# Altium project Nixie_Control.PrjPcb
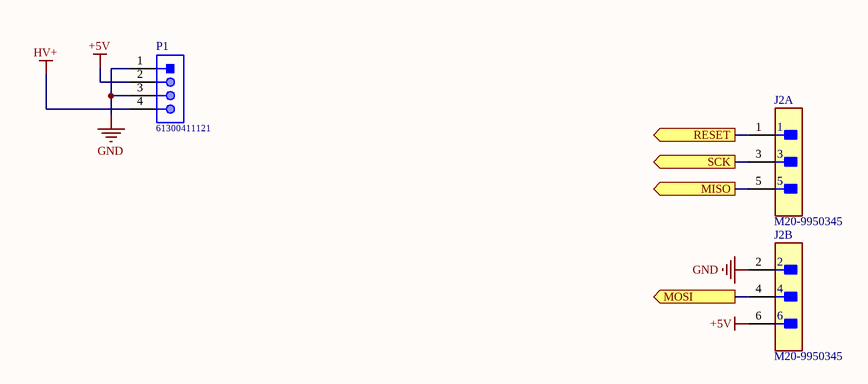
[diagram p0: Connectors.SchDoc]
4 sheets, 32 parts. Net scope: flat (ports and power ports of the same name join across sheets).
Board file: Nixie_Control.PcbDoc
Sheets:
  Connectors.SchDoc
  IN_12A.SchDoc
  ATMega1284p.SchDoc
  DS1307.SchDoc

## Sheet Connectors.SchDoc
size A; SheetNumber: 1; SheetTotal: 4

### Parts
J2  M20-9950345  [FP-M20-9950345-MFG]  (parts A,B of 2)
P1  61300411121  [61300411121]

### Ports
MISO (out), MOSI (out), RESET (out), SCK (out)

### Nets
+5V: J2.6 P1.2
GND: J2.2 P1.1 P1.3
HV+: P1.4
NetJ2_1: J2.1 ; port RESET
NetJ2_3: J2.3 ; port SCK
NetJ2_4: J2.4 ; port MOSI
NetJ2_5: J2.5 ; port MISO

### Library data of the parts
J2 = CMP-15831-000002-1: CONN HEADER R/A 6POS 2.54MM; Manufacturer: Harwin; Conn Gender: Male; Number Of Contacts: 6; Conn Orientation: Right Angle; Current Rating: 3A; Device Class L2: Headers and Wire Housings; Temperature: -40°C to +105°C; Device Class L1: Connectors; RoHS: TRUE; Temperature Range Low: -40°C; ComponentLink2URL: https://cdn.harwin.com/pdfs/M20-995.pdf; Height: 5.28mm; Digikey Description: CONN HEADER R/A 6POS 2.54MM; Pitch: 2.54mm; Manufacturer Part Number: M20-9950345; Device Class L3: unset; Ipc Land Pattern Name: DFN400X400X80-14; Automotive: No; Octopart: https://octopart.com/m20-9950345-harwin-21265213; Category: Conn; Mouser Description: Headers & Wire Housings 03+03 DIL HORIZONTAL PIN HEADER GOLD HT; Package: 0; Number Of Rows: 2; Contact Material: Gold,Nickel; Lead Free: Yes; ComponentLink2Description: Datasheet; Temperature Range High: +105°C
P1 = CMP-1502-01064-1: THT Vertical Pin Header WR-PHD, Pitch 2.54 mm, Single Row, 4 pins; Manufacturer: Wurth Elektronik; Withstanding Voltage: 500VAC; Rated Current: 3A; Working Voltage: 250VAC; Pin Number: 4; Gender: Male; Contact Resistance: 20mOhm; Pitch: 2.54mm; Manufacturer URL: http://www.we-online.de; Operating Temperature: -40to105degC; Packaging: Bag; Mounting Technology: THT; Package Reference: 61300411121; Datasheet URL: https://katalog.we-online.de/em/datasheet/6130xx11121.pdf; Publisher: WurthElektronik; Part Number: 61300411121; Row Number: Single; Orientation: Vertical

## Sheet IN_12A.SchDoc
size 431 x 279 mm; SheetNumber: 2; SheetTotal: 7
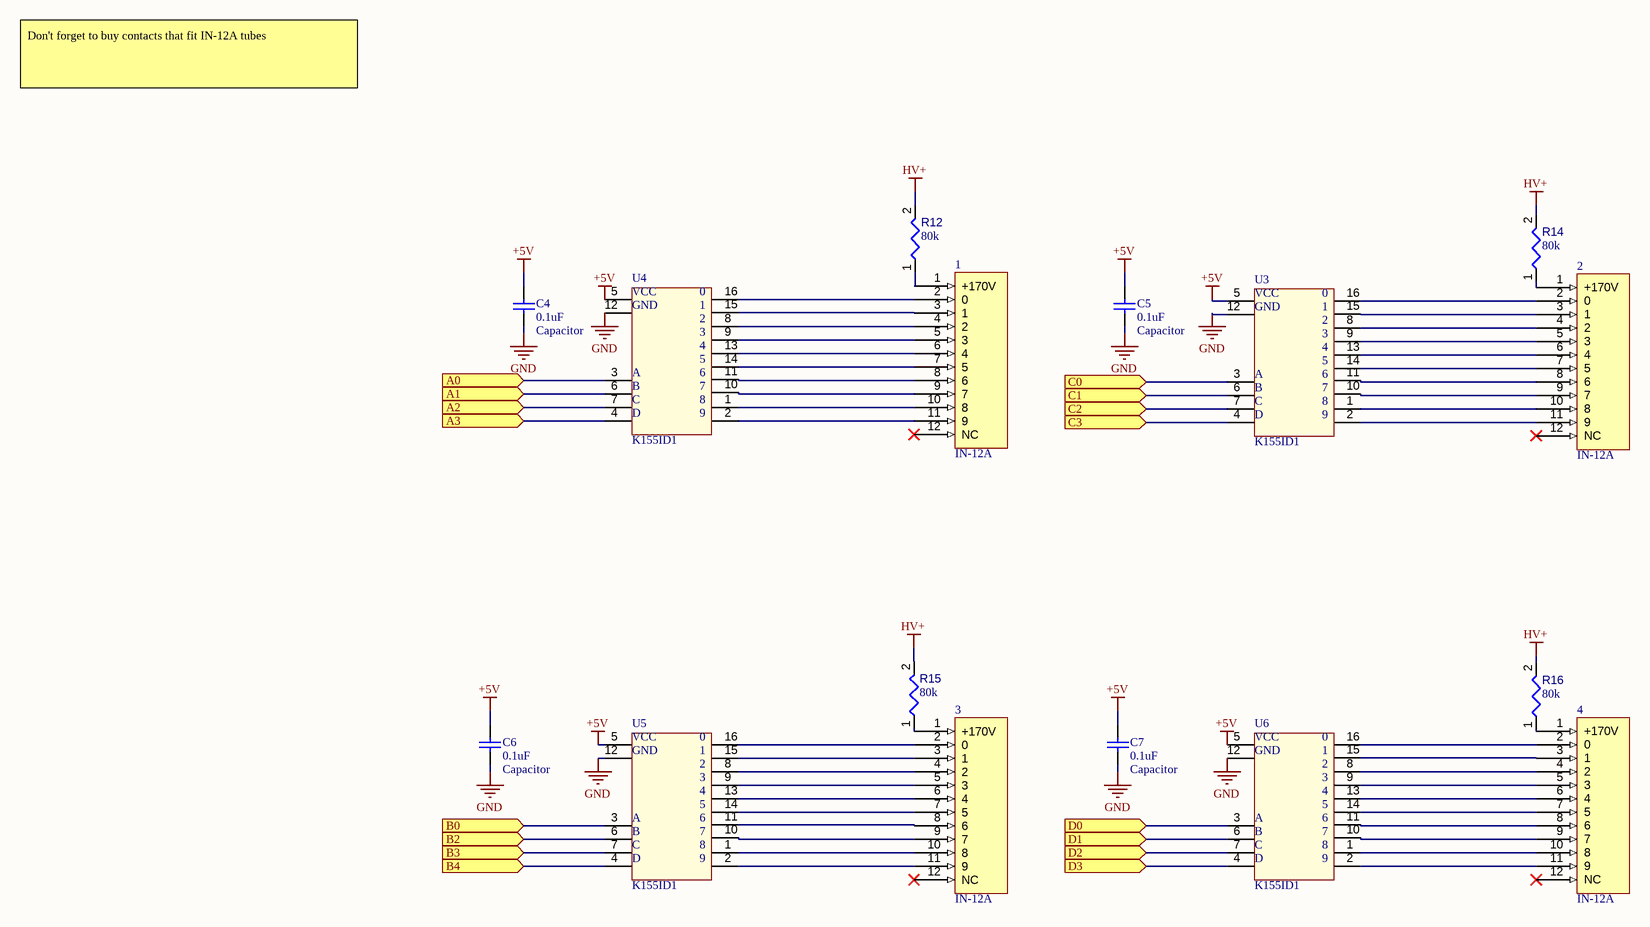
[diagram p1: IN_12A.SchDoc]

### Parts
1  IN-12A  [IN-12A]
2  IN-12A  [IN-12A]
3  IN-12A  [IN-12A]
4  IN-12A  [IN-12A]
C4  value 0.1uF  Type: Capacitor  [FOOTPRINT-1206-GEN]  (hidden comment: Capacitor - 0.1uF - 1206)
C5  value 0.1uF  Type: Capacitor  [FOOTPRINT-1206-GEN]  (hidden comment: Capacitor - 0.1uF - 1206)
C6  value 0.1uF  Type: Capacitor  [FOOTPRINT-1206-GEN]  (hidden comment: Capacitor - 0.1uF - 1206)
C7  value 0.1uF  Type: Capacitor  [FOOTPRINT-1206-GEN]  (hidden comment: Capacitor - 0.1uF - 1206)
R12  value 80k  [RESC3216X60X45ML15T20]  (hidden comment: Resistor 80k +/-1% 1206 250 mW)
R14  value 80k  [RESC3216X60X45ML15T20]  (hidden comment: Resistor 80k +/-1% 1206 250 mW)
R15  value 80k  [RESC3216X60X45ML15T20]  (hidden comment: Resistor 80k +/-1% 1206 250 mW)
R16  value 80k  [RESC3216X60X45ML15T20]  (hidden comment: Resistor 80k +/-1% 1206 250 mW)
U3  K155ID1  [Socket_DIP_16]
U4  K155ID1  [Socket_DIP_16]
U5  K155ID1  [Socket_DIP_16]
U6  K155ID1  [Socket_DIP_16]

### Ports
A0 (in), A1 (in), A2 (in), A3 (in), B0 (in), B2 (in), B3 (in), B4 (in), C0 (in), C1 (in), C2 (in), C3 (in), D0 (in), D1 (in), D2 (in), D3 (in)

### Nets
+5V: C4.2 C5.2 C6.2 C7.2 U3.5 U4.5 U5.5 U6.5
GND: C4.1 C5.1 C6.1 C7.1 U3.12 U4.12 U5.12 U6.12
HV+: R12.2 R14.2 R15.2 R16.2
Net1_1: 1.1(+170V) R12.1
Net1_2: 1.2(0) U4.16
Net1_3: 1.3(1) U4.15
Net1_4: 1.4(2) U4.8
Net1_5: 1.5(3) U4.9
Net1_6: 1.6(4) U4.13
Net1_7: 1.7(5) U4.14
Net1_8: 1.8(6) U4.11
Net1_9: 1.9(7) U4.10
Net1_10: 1.10(8) U4.1
Net1_11: 1.11(9) U4.2
Net2_1: 2.1(+170V) R14.1
Net2_2: 2.2(0) U3.16
Net2_3: 2.3(1) U3.15
Net2_4: 2.4(2) U3.8
Net2_5: 2.5(3) U3.9
Net2_6: 2.6(4) U3.13
Net2_7: 2.7(5) U3.14
Net2_8: 2.8(6) U3.11
Net2_9: 2.9(7) U3.10
Net2_10: 2.10(8) U3.1
Net2_11: 2.11(9) U3.2
Net3_1: 3.1(+170V) R15.1
Net3_2: 3.2(0) U5.16
Net3_3: 3.3(1) U5.15
Net3_4: 3.4(2) U5.8
Net3_5: 3.5(3) U5.9
Net3_6: 3.6(4) U5.13
Net3_7: 3.7(5) U5.14
Net3_8: 3.8(6) U5.11
Net3_9: 3.9(7) U5.10
Net3_10: 3.10(8) U5.1
Net3_11: 3.11(9) U5.2
Net4_1: 4.1(+170V) R16.1
Net4_2: 4.2(0) U6.16
Net4_3: 4.3(1) U6.15
Net4_4: 4.4(2) U6.8
Net4_5: 4.5(3) U6.9
Net4_6: 4.6(4) U6.13
Net4_7: 4.7(5) U6.14
Net4_8: 4.8(6) U6.11
Net4_9: 4.9(7) U6.10
Net4_10: 4.10(8) U6.1
Net4_11: 4.11(9) U6.2
NetU1_13: U5.3 ; port B0
NetU1_14: U5.6 ; port B2
NetU1_15: U5.7 ; port B3
NetU1_16: U5.4 ; port B4
NetU1_19: U6.3 ; port D0
NetU1_20: U6.6 ; port D1
NetU1_21: U6.7 ; port D2
NetU1_22: U6.4 ; port D3
NetU1_23: U4.3 ; port A0
NetU1_24: U4.6 ; port A1
NetU1_25: U4.7 ; port A2
NetU1_26: U4.4 ; port A3
NetU1_30: U3.4 ; port C3
NetU1_31: U3.7 ; port C2
NetU1_32: U3.6 ; port C1
NetU1_33: U3.3 ; port C0

Not connected (* = marked no-connect by the designer): 1 12(NC)*; 2 12(NC)*; 3 12(NC)*; 4 12(NC)*

### Notes on the sheet
- Don't forget to buy contacts that fit IN-12A tubes
- DWG. NO.
- REV.
- SHT.
- THIS DOCUMENT AND THE DATA DISCLOSED HEREIN OR HEREWITH IS THE PROPERTY OF ALTIUM LIMITED AND MAY BE FREELY DISTRIBUTED IN WHOLE. NO RIGHTS ARE RESERVED OR EXPRESS OR IMPLIED WARANTEE GIVEN.
- REVISION
- DESCRIPTION
- DATE
- APPROVED
- ENG:
- APPROVALS
- PROJECT
- DSN:
- CHK:
- REFERENCE DOCUMENTS
- PROJECT REVISION:
- TITLE
- DOCUMENT REVISION:
- DESIGN ITEM:
- BOM:
- FAB DWG:
- PCB DWG:
- ASSY DWG:
- SCALE:
- SIZE
- B
- CAGE CODE
- FILE NAME
- DWG NO.
- SHEET
- OF
- REV
- (in symbol K155ID1) VCC; 0; GND; A; B; C; D

### Library data of the parts
C4-C7 = CMP-001-00096-1: CAP CER 0.1UF 50V X7R 1206; Part Number: 1276-7034-1-ND; PackageReference: RAD-0.3; Published: 8-Jun-2000; Source: Generic.SchLib; Design Item ID: Capacitor-Generic-1206; LatestRevisionNote: Re-released for DXP Platform.; PackageDescription: Radial Cap, Thru-Hole; 2 Leads; 0.3 in Pin Spacing; Publisher: Altium Limited
R12 R14-R16 = CMP-009-00016-4: Chip Resistor, 80 KOhm, +/- 1%, 0.25 W, -55 to 155 degC, 1206 (3216 Metric); Power: 250mW; Voltage Rating: 200V; Max Operating Temperature: 155°C; Mounting Technology: SM; Case/Package: 1206; Pins: 2; Min Operating Temperature: -55°C; RoHS Compliant: True; Tolerance: 1%

## Sheet ATMega1284p.SchDoc
size A; SheetNumber: 3; SheetTotal: 4
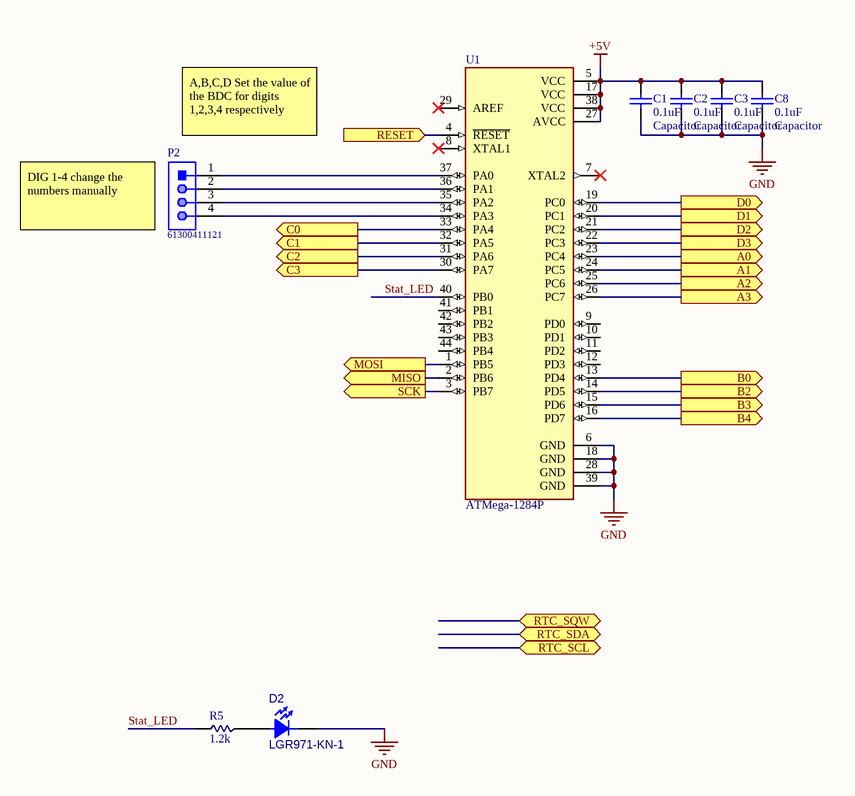
[diagram p2: ATMega1284p.SchDoc]

### Parts
C1  value 0.1uF  Type: Capacitor  [FOOTPRINT-1206-GEN]  (hidden comment: Capacitor - 0.1uF - 1206)
C2  value 0.1uF  Type: Capacitor  [FOOTPRINT-1206-GEN]  (hidden comment: Capacitor - 0.1uF - 1206)
C3  value 0.1uF  Type: Capacitor  [FOOTPRINT-1206-GEN]  (hidden comment: Capacitor - 0.1uF - 1206)
C8  value 0.1uF  Type: Capacitor  [FOOTPRINT-1206-GEN]  (hidden comment: Capacitor - 0.1uF - 1206)
D2  LGR971-KN-1  [FOOTPRINT-OSRAM-CHIPLED-0805-1A2K]
P2  61300411121  [61300411121]
R5  value 1.2k  [FOOTPRINT-0805-GEN]  (hidden comment: RMCF0805FT1K20)
U1  ATMega-1284P  [QFP80P1200X1200X120-44N]

### Ports
A0 (out), A1 (out), A2 (out), A3 (out), B0 (out), B2 (out), B3 (out), B4 (out), C0 (out), C1 (out), C2 (out), C3 (out), D0 (out), D1 (out), D2 (out), D3 (out), MISO (out), MOSI (out), RESET (in), RTC_SCL (bidir), RTC_SDA (bidir), RTC_SQW (bidir), SCK (out)

### Nets
+5V: C1.2 C2.2 C3.2 C8.2 U1.5(VCC) U1.17(VCC) U1.27(AVCC) U1.38(VCC)
GND: C1.1 C2.1 C3.1 C8.1 D2.2(K) U1.6(GND) U1.18(GND) U1.28(GND) U1.39(GND)
Stat_LED: R5.2 U1.40(PB0)
NetD2_1: D2.1(A) R5.1
NetJ2_1: U1.4(~{RESET}) ; port RESET
NetJ2_3: U1.3(PB7) ; port SCK
NetJ2_4: U1.1(PB5) ; port MOSI
NetJ2_5: U1.2(PB6) ; port MISO
NetP2_1: P2.1 U1.37(PA0)
NetP2_2: P2.2 U1.36(PA1)
NetP2_3: P2.3 U1.35(PA2)
NetP2_4: P2.4 U1.34(PA3)
NetU1_13: U1.13(PD4) ; port B0
NetU1_14: U1.14(PD5) ; port B2
NetU1_15: U1.15(PD6) ; port B3
NetU1_16: U1.16(PD7) ; port B4
NetU1_19: U1.19(PC0) ; port D0
NetU1_20: U1.20(PC1) ; port D1
NetU1_21: U1.21(PC2) ; port D2
NetU1_22: U1.22(PC3) ; port D3
NetU1_23: U1.23(PC4) ; port A0
NetU1_24: U1.24(PC5) ; port A1
NetU1_25: U1.25(PC6) ; port A2
NetU1_26: U1.26(PC7) ; port A3
NetU1_30: U1.30(PA7) ; port C3
NetU1_31: U1.31(PA6) ; port C2
NetU1_32: U1.32(PA5) ; port C1
NetU1_33: U1.33(PA4) ; port C0

Not connected (* = marked no-connect by the designer): U1 7(XTAL2)* 8(XTAL1)* 9(PD0) 10(PD1) 11(PD2) 12(PD3) 29(AREF)* 41(PB1) 42(PB2) 43(PB3) 44(PB4)

### Notes on the sheet
- (near P2) A,B,C,D Set the value of the BDC for digits 1,2,3,4 respectively
- (near P2) DIG 1-4 change the numbers manually

### Library data of the parts
C1-C3 C8 = CMP-001-00096-1: as C4 on sheet IN_12A; PackageReference: RAD-0.3; Published: 8-Jun-2000; Source: Generic.SchLib; Design Item ID: Capacitor-Generic-1206; LatestRevisionNote: Re-released for DXP Platform.; PackageDescription: Radial Cap, Thru-Hole; 2 Leads; 0.3 in Pin Spacing; Publisher: Altium Limited
D2 = CMP-017-000003-2: LED Uni-Color Green 572nm 2-Pin Chip 0805(2012Metric) T/R; Part Number: 475-1410-1-ND; Current - Maximum: 25mA; Current - Test: 20mA; Forward Voltage: 2.2V; Design Item ID: LED-OSRAM-LG-R971-KN-1; Source: Discrete.SchLib
P2 = CMP-1502-01064-1: as P1 on sheet Connectors; Manufacturer URL: http://www.we-online.de; Operating Temperature: -40to105degC; Packaging: Bag; Mounting Technology: THT; Package Reference: 61300411121; Datasheet URL: https://katalog.we-online.de/em/datasheet/6130xx11121.pdf; Publisher: WurthElektronik; Part Number: 61300411121; Row Number: Single; Orientation: Vertical
R5 = CMP-009-00185-2: Res Thick Film 0805 1.2K Ohm 1% 0.125W ±100ppm/°C Molded SMD Paper T/R; Design Item ID: Resistor-Generic-0805-2012; Source: Generic.SchLib; Type: Resistor

## Sheet DS1307.SchDoc
size A; SheetNumber: 6; SheetTotal: 7
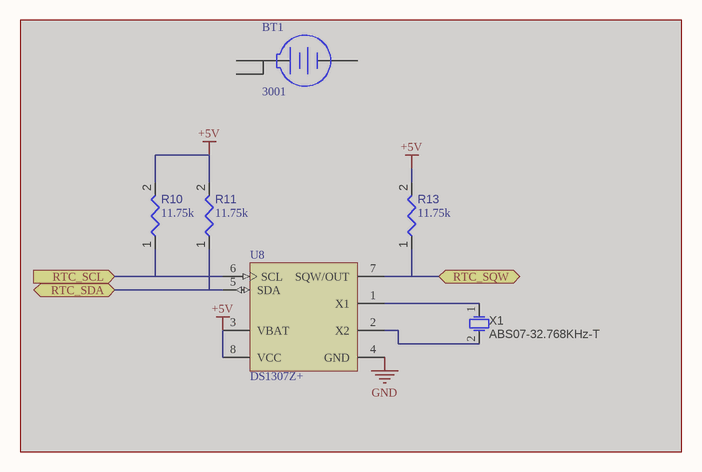
[diagram p3: DS1307.SchDoc]

### Parts
BT1  3001  [KSTN-3001_V]  (masked out: inside a compile mask, not in the netlist)
R10  value 11.75k  [RESC3216X60X45ML15T20]  (hidden comment: Resistor 11.75k +/-1% 1206 250 mW)  (masked out: inside a compile mask, not in the netlist)
R11  value 11.75k  [RESC3216X60X45ML15T20]  (hidden comment: Resistor 11.75k +/-1% 1206 250 mW)  (masked out: inside a compile mask, not in the netlist)
R13  value 11.75k  [RESC3216X60X45ML15T20]  (hidden comment: Resistor 11.75k +/-1% 1206 250 mW)  (masked out: inside a compile mask, not in the netlist)
U8  DS1307Z+  [S8+2_L]  (masked out: inside a compile mask, not in the netlist)
X1  ABS07-32.768KHz-T  [ABRA-ABS07-2_V]  (masked out: inside a compile mask, not in the netlist)

### Ports
RTC_SCL (in), RTC_SDA (bidir), RTC_SQW (bidir)

### Library data of the parts
BT1 = CMP-2000-05463-1: Holder Battery Coin, 12 mm, 2-Pin THD, RoHS; Manufacturer: Keystone; Package Reference: 3001; Package Description: 2-Pin Through Hole Device, Body 13.21 x 12.07 mm; Datasheet Version: Rev. H, 09/2006; Datasheet URL: https://datasheet.ciiva.com/3/3001-3954.pdf; Mounting Technology: ThroughHole; Manufacturer URL: http://www.keyelco.com/
R10 R11 R13 = CMP-009-00016-4: Chip Resistor, 11.75KOhm, +/- 1%, 0.25 W, -55 to 155 degC, 1206 (3216 Metric); Power: 250mW; Voltage Rating: 200V; Max Operating Temperature: 155°C; Mounting Technology: SM; Case/Package: 1206; Pins: 2; Min Operating Temperature: -55°C; RoHS Compliant: True; Tolerance: 1%
U8 = CMP-0254-00308-1: 64 x 8, Serial, I2C Real-Time Clock, 5.0V, 8-Pin SO, 0 to 70 degC, Pb-Free; ComponentLink3Description: Package Specification; DatasheetVersion: 10-Feb-2008; Code_IPC: SOIC127P600-8; ComponentLink2Description: Datasheet; Code_JEDEC: MS-012-AA; ComponentLink2URL: http://datasheets.maxim-ic.com/en/ds/DS1307.pdf; ComponentLink3URL: http://pdfserv.maxim-ic.com/package_dwgs/21-0041.PDF; ComponentLink1URL: http://www.maxim-ic.com; PackageReference: S8+2; ComponentLink1Description: Manufacturer URL; PackageDescription: 8-Pin Small-Outline IC, Narrow (0.15in), 1.27 mm Pitch, SOIC (N), Pb-Free; PackageVersion: revC, 2010
X1 = CMP-003-00022-1: Low Profile Crystal, 32.768 kHz, +/- 20 ppm, 12.5 pF, -40 to 85 degC, 2-Pin SMD, Pb-Free, Tape and Reel; Manufacturer: Abracon; Tolerance: 20ppm; Load Capacitance: 12.5pF; ESR: 70k; Case/Package: CSMD; Datasheet Version: Aug-15; Pins: 2; Max Operating Temperature: 85°C; Package Description: 2-Pin Surface Mount Device, Body 3.2 x 1.5 mm; Manufacturer URL: http://www.abracon.com/; Package URL: http://www.abracon.com/Support/PackageDrawing/Resonators/ABS07.PDF; Min Operating Temperature: -40°C; Packaging: TapeandReel; RoHS Compliant: True; Package Reference: ABS07-2; Frequency Tolerance: 20ppm; Frequency: 32.768kHz; Datasheet URL: http://www.abracon.com/Resonators/ABS07.pdf; Package Quantity: 3000; Mounting Technology: SM

## Nets that join several sheets
+5V: Connectors (J2.6 P1.2), IN_12A (8 pins), ATMega1284p (8 pins)
GND: Connectors (J2.2 P1.1 P1.3), IN_12A (8 pins), ATMega1284p (9 pins)
HV+: Connectors (P1.4), IN_12A (R12.2 R14.2 R15.2 R16.2)
NetJ2_1: Connectors (J2.1), ATMega1284p (U1.4)
NetJ2_3: Connectors (J2.3), ATMega1284p (U1.3)
NetJ2_4: Connectors (J2.4), ATMega1284p (U1.1)
NetJ2_5: Connectors (J2.5), ATMega1284p (U1.2)
NetU1_13: IN_12A (U5.3), ATMega1284p (U1.13)
NetU1_14: IN_12A (U5.6), ATMega1284p (U1.14)
NetU1_15: IN_12A (U5.7), ATMega1284p (U1.15)
NetU1_16: IN_12A (U5.4), ATMega1284p (U1.16)
NetU1_19: IN_12A (U6.3), ATMega1284p (U1.19)
NetU1_20: IN_12A (U6.6), ATMega1284p (U1.20)
NetU1_21: IN_12A (U6.7), ATMega1284p (U1.21)
NetU1_22: IN_12A (U6.4), ATMega1284p (U1.22)
NetU1_23: IN_12A (U4.3), ATMega1284p (U1.23)
NetU1_24: IN_12A (U4.6), ATMega1284p (U1.24)
NetU1_25: IN_12A (U4.7), ATMega1284p (U1.25)
NetU1_26: IN_12A (U4.4), ATMega1284p (U1.26)
NetU1_30: IN_12A (U3.4), ATMega1284p (U1.30)
NetU1_31: IN_12A (U3.7), ATMega1284p (U1.31)
NetU1_32: IN_12A (U3.6), ATMega1284p (U1.32)
NetU1_33: IN_12A (U3.3), ATMega1284p (U1.33)